# Altium schematic sheet SHDN-BSPD-S11-V00-ShutdownRelay.SchDoc: Shutdown Relay
size A3; DrawnBy: Jonn Dillon; DocumentNumber: 11; Revision: 01; SheetNumber: 11; SheetTotal: 12
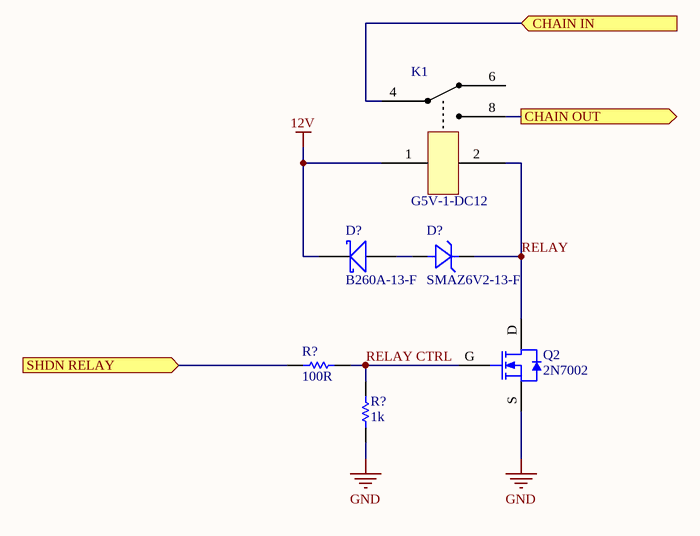
[diagram p0: SHDN-BSPD-S11-V00-ShutdownRelay.SchDoc]

## Parts
(Parts that share a designator on the sheet are numbered #1, #2 ... from top to bottom, then left to right.)
D?#1  B260A-13-F  [SMA]
D?#2  SMAZ6V2-13-F  [SMA]
K1  G5V-1-DC12  [G5V-1]
Q2  2N7002  [SOT23-3]
R?#1  100R  [Res_ThinFilm_0603]
R?#2  1k  [Res_ThinFilm_0603]

## Ports
CHAIN IN (in), CHAIN OUT (out), SHDN RELAY (in)

## Nets
12V: D?#1.K K1.1
GND: Q2.S R?#2.1
CHAIN IN: K1.4 ; port CHAIN IN
CHAIN OUT: K1.8 ; port CHAIN OUT
RELAY: D?#2.K(Cathode) K1.2 Q2.D
RELAY CTRL: Q2.G R?#1.2 R?#2.2
SHDN RELAY: R?#1.1 ; port SHDN RELAY
NetD?#1_A: D?#1.A D?#2.A(Anode)

Not connected (* = marked no-connect by the designer): K1 6

## Notes on the sheet
- Revision History:
- Sheet Title:
- Rev
- Date
- Description
- Project:
- Size:
- Drawn By:
- A3
- Number:
- Revision:
- Sheet
- Version:
- of
- QUT Motorsport
- O-120, Gardens Point
- 2 George Street
- Brisbane, QLD 4000
- Australia
- Print Date:
- Print Time:
- File Name:

## Library data of the parts
D?#1 = B260A-13-F: Diode, Schottky Barrier Rectifier, 60 V, 2 A, B260A-13-F
D?#2 = SMAZ6V2-13-F: Zener Diode 6.2V 1W ±5% Surface Mount SMA; Manufacturer: Generic; MPN: 5V6 500mW SMA
K1 = G5V-1-DC12: General Purpose Relay SPDT (1 Form C) Through Hole, 12V, 2A
R?#1 = 100R 5%, 0603: Resistor, SMD, 100R, 0.1W, 5%, 0603
R?#2 = 1k 5% 0603: Resistor, SMD, 1k, 0.1W, 5%, 0603